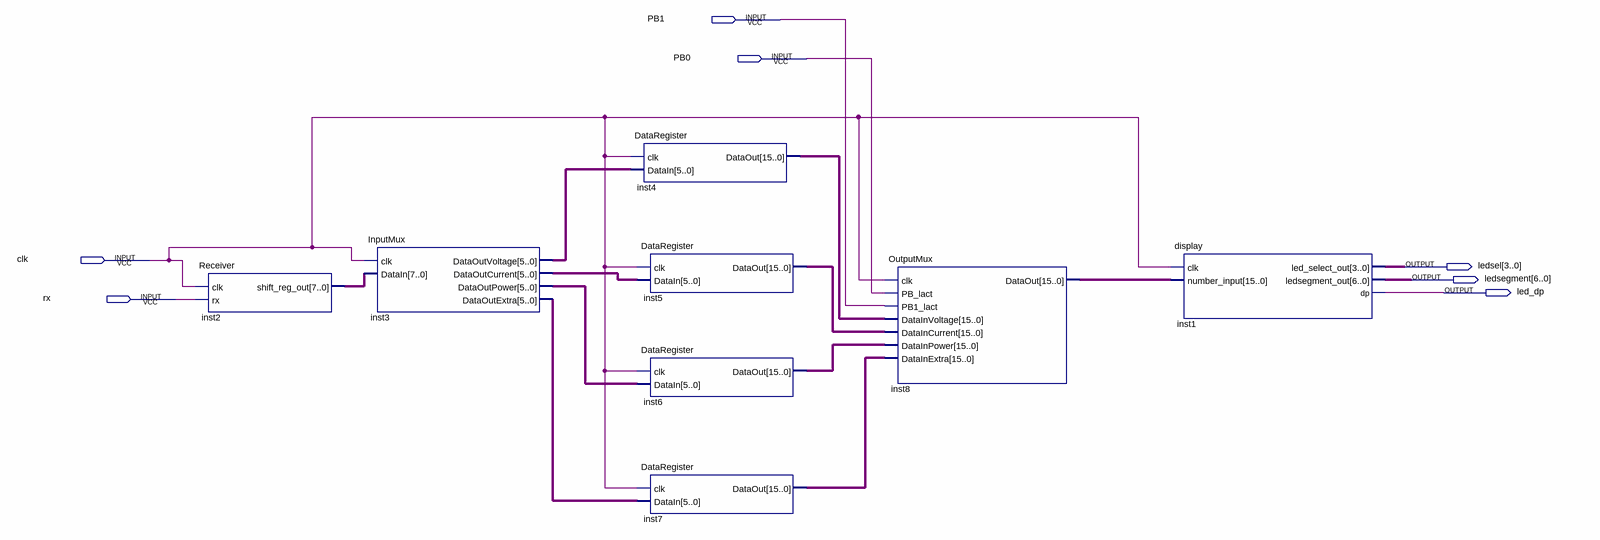
[diagram p0: schematic sheet]
// Quartus schematic FullBaseStation.bdf as structural Verilog: 8 symbols, 7 pins
module FullBaseStation (
  input  PB1,
  input  PB0,
  input  clk,
  input  rx,
  output [3:0] ledsel,
  output [6:0] ledsegment,
  output led_dp
);

  wire [5:0] inst3_dataoutcurrent, inst3_dataoutextra, inst3_dataoutpower, inst3_dataoutvoltage;
  wire [7:0] inst2_shift_reg_out;
  wire [15:0] inst4_dataout, inst5_dataout, inst6_dataout, inst7_dataout, inst8_dataout;

  Receiver inst2 (.clk(clk), .rx(rx), .shift_reg_out(inst2_shift_reg_out));
  InputMux inst3 (
    .clk(clk), .DataIn(inst2_shift_reg_out), .DataOutVoltage(inst3_dataoutvoltage),
    .DataOutCurrent(inst3_dataoutcurrent), .DataOutPower(inst3_dataoutpower),
    .DataOutExtra(inst3_dataoutextra));
  DataRegister inst4 (.clk(clk), .DataIn(inst3_dataoutvoltage), .DataOut(inst4_dataout));
  DataRegister inst5 (.clk(clk), .DataIn(inst3_dataoutcurrent), .DataOut(inst5_dataout));
  DataRegister inst6 (.clk(clk), .DataIn(inst3_dataoutpower), .DataOut(inst6_dataout));
  DataRegister inst7 (.clk(clk), .DataIn(inst3_dataoutextra), .DataOut(inst7_dataout));
  OutputMux inst8 (
    .clk(clk), .PB_lact(PB0), .PB1_lact(PB1), .DataInVoltage(inst4_dataout), .DataInCurrent(inst5_dataout),
    .DataInPower(inst6_dataout), .DataInExtra(inst7_dataout), .DataOut(inst8_dataout));
  display inst1 (
    .clk(clk), .number_input(inst8_dataout), .led_select_out(ledsel), .ledsegment_out(ledsegment), .dp(led_dp));
endmodule
